# EAGLE design LilyPad_SimpleSnap_ProtoBoard (EAGLE 7.2.0)
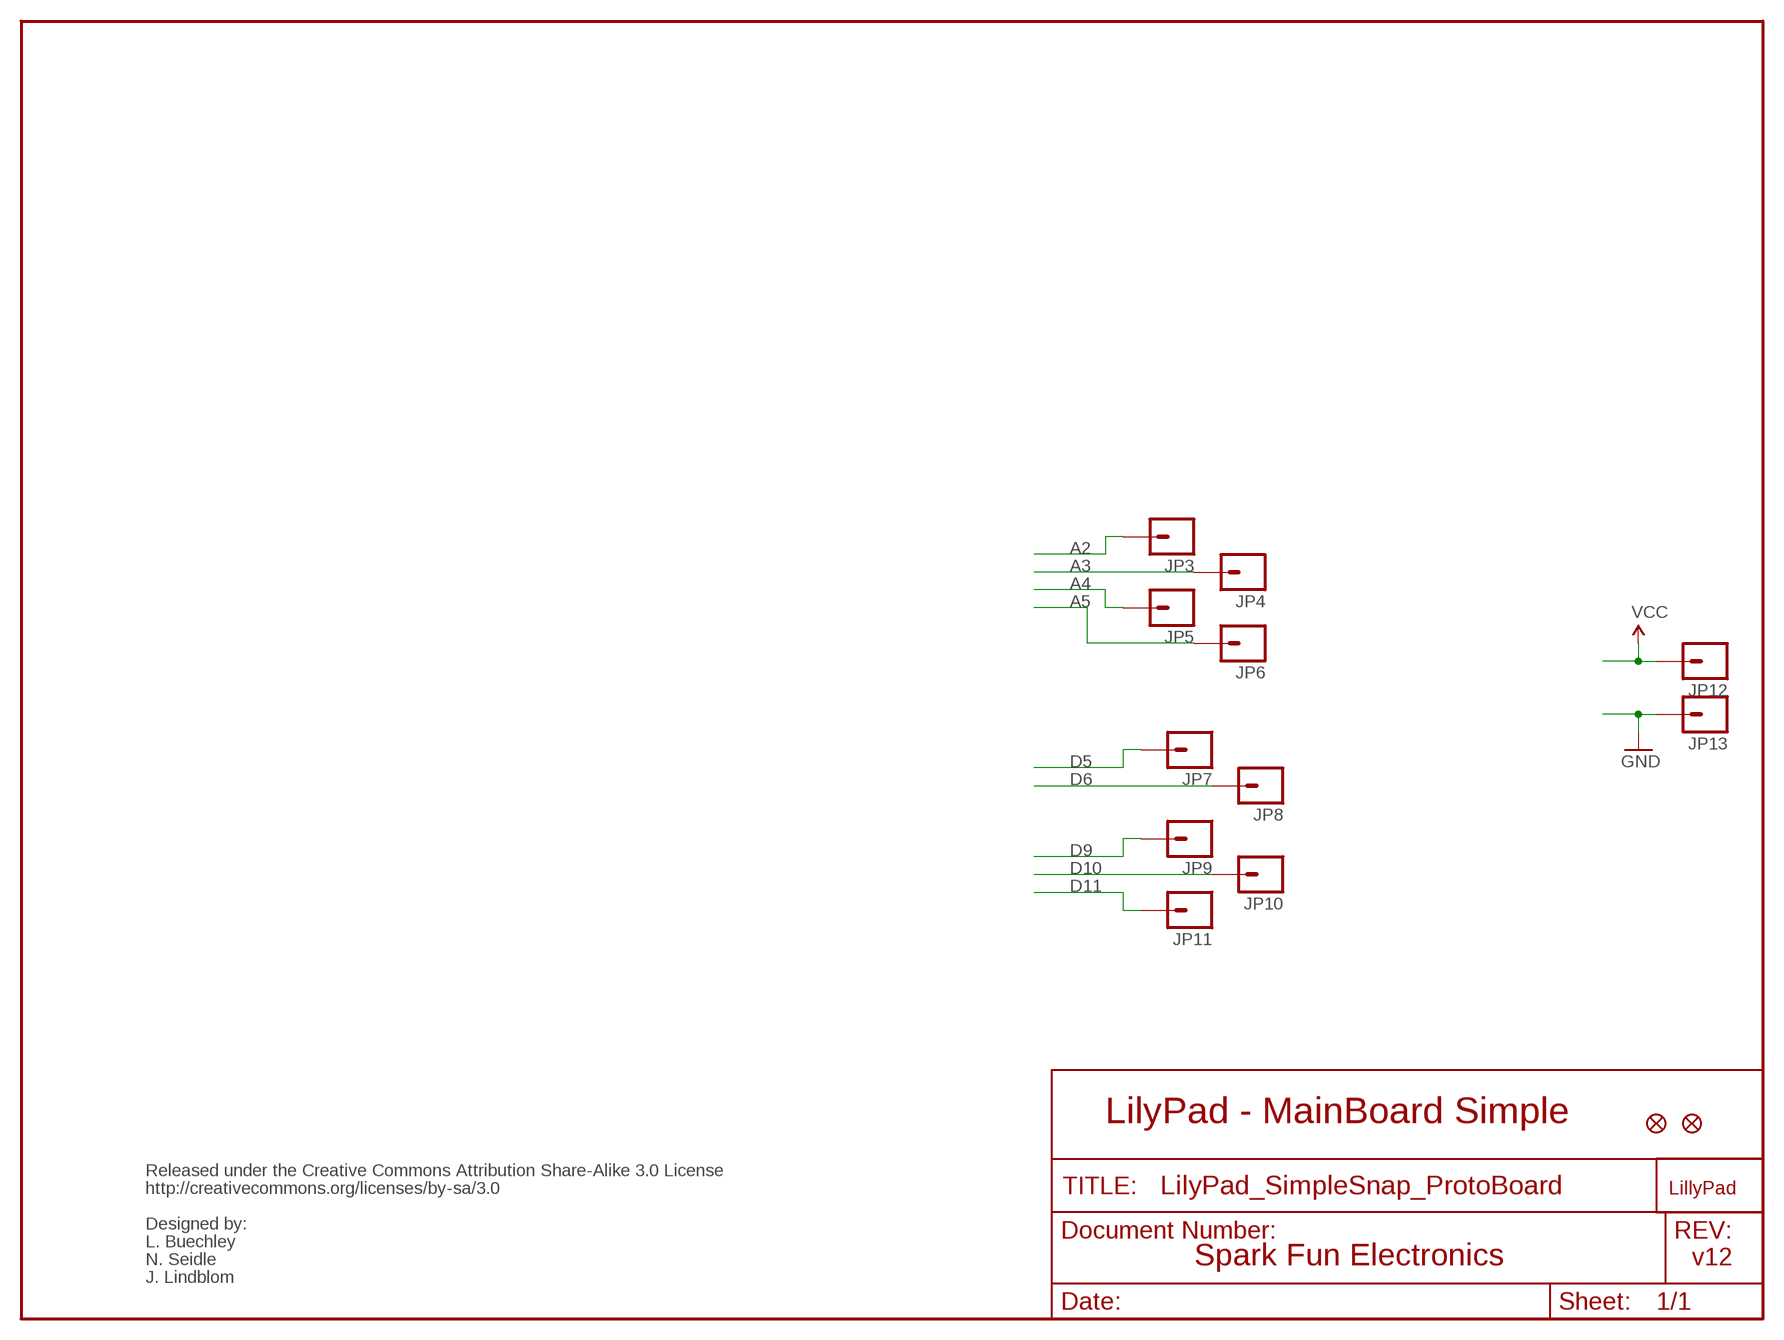
[diagram p0: schematic, sheet 1]

## Parts
JP1  FIDUCIALUFIDUCIAL  [MICRO-FIDUCIAL]
JP2  FIDUCIALUFIDUCIAL  [MICRO-FIDUCIAL]
JP3  M01SNAP-MALE_LARGE  [SNAP-MALE_LARGE]
JP4  M01SNAP-MALE_LARGE  [SNAP-MALE_LARGE]
JP5  M01SNAP-MALE_LARGE  [SNAP-MALE_LARGE]
JP6  M01SNAP-MALE_LARGE  [SNAP-MALE_LARGE]
JP7  M01SNAP-MALE_LARGE  [SNAP-MALE_LARGE]
JP8  M01SNAP-MALE_LARGE  [SNAP-MALE_LARGE]
JP9  M01SNAP-MALE_LARGE  [SNAP-MALE_LARGE]
JP10  M01SNAP-MALE_LARGE  [SNAP-MALE_LARGE]
JP11  M01SNAP-MALE_LARGE  [SNAP-MALE_LARGE]
JP12  M01SNAP-MALE_LARGE  [SNAP-MALE_LARGE]
JP13  M01SNAP-MALE_LARGE  [SNAP-MALE_LARGE]
U$1  LOGO-LPLP  [LOGO-LILYPAD]

## Nets
A2: JP3.2
A3: JP4.2
A4: JP5.2
A5: JP6.2
D5: JP7.2
D6: JP8.2
D9: JP9.2
D10: JP10.2
D11: JP11.2
GND [VCC]: JP13.2
VCC [VCC]: JP12.2

## Notes on the sheet
- LilyPad - MainBoard Simple
- Released under the Creative Commons Attribution Share-Alike 3.0 License
- http://creativecommons.org/licenses/by-sa/3.0
- Designed by:
- L. Buechley
- N. Seidle | Spark Fun Electronics | v12
- J. Lindblom

## Library data of the parts
JP1 JP2 = SparkFun:FIDUCIAL: Fiducial Alignment Points Various fiducial points for machine vision alignment.
JP3-JP13 = SparkFun:M01: Header 1 Standard 1-pin 0.1" header. Use with straight break away headers (SKU : PRT-00116), right angle break away headers (PRT-00553), swiss pins (PRT-00743), machine pins (PRT-00117), and female headers (PRT-00115).
U$1 = LilyPad-Wearables:LOGO-LP

## Net classes
0 Default: width 0.203 mm
1 VCC: width 0.254 mm

## Board
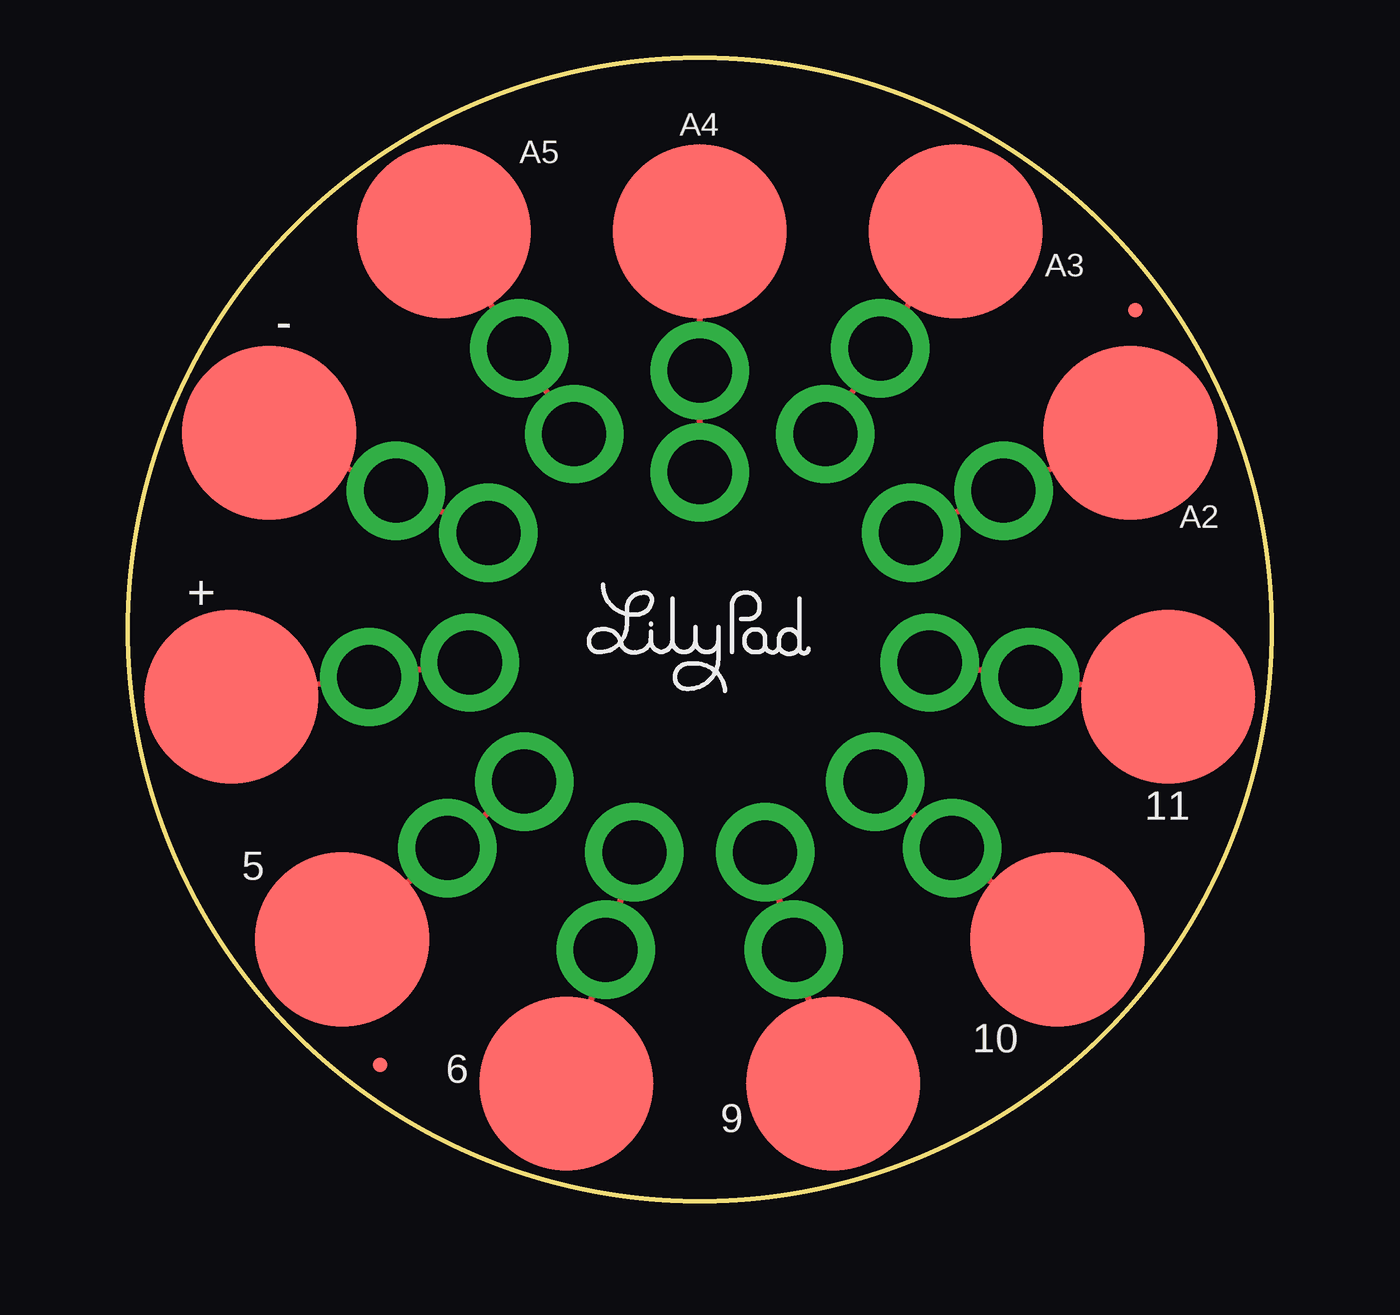
[diagram p1: board, top side]

Size 50 x 50 mm. Coordinates in mm from the lower left corner, seen from the top.
Outline: circle at 25,25 radius 25
Copper layers (1*16): Top 0.035mm / dielectric 1.5mm / Bottom 0.035mm
Design rules "default": minimum track width 8mil, minimum drill 20mil, track to track 8mil, track to pad 8mil, pad to pad 8mil, via to via 8mil, smd to smd 8mil, copper to edge 8mil, drill to drill 8mil, minimum pad ring 12mil, minimum via ring 10mil, stop-mask expansion 4mil, vias tented up to drill 20mil, thermal gap 10mil
bRestrict: area -3.2,-3.2 to 53.2,53.2; area 2.4,2.4 to 47.6,47.6; area 21,42.8 to 23.5,44; area 31.6,41.3 to 34.4,43; area 36.3,38.4 to 38.9,40.7; area 40,34.1 to 42,36.9; area 42.2,29.2 to 43.6,31.8; area 42.8,23.9 to 44,26.2; area 42.2,18.2 to 43.7,20.9; area 36.3,9.4 to 39,11.7; area 31.7,7 to 34.5,8.7; area 26.5,6 to 28.9,7.3; area 21.1,6 to 23.6,7.3; area 15.6,7 to 18.3,8.7; area 11,9.3 to 13.8,11.6; area 8,13.1 to 10.1,15.9; area 6.4,18.2 to 8,20.8; area 6,23.7 to 7.2,26.2; area 6.3,29.1 to 7.9,31.7; area 8,34 to 10.1,36.9; area 11,38.3 to 13.7,40.6; area 15.4,41.2 to 18.4,43; area 26.4,42.5 to 29.1,44; area 40,13 to 42,16.1; 22 lines

### Footprints (pad centres in the part's own frame; a part is rotated, then mirrored left to right if it is on the bottom)
MICRO-FIDUCIAL = smd 0.635 x 0.635: 1 0,0
SNAP-MALE_LARGE = smd 7.62 x 7.62: 2 0,0

### Placement (x,y rotation side)
JP1  11.03,5.95 0 top
JP2  44.05,38.97 0 top
JP3  43.83,33.6 0 top
JP4  36.19,42.41 0 top
JP5  25,42.41 0 top
JP6  13.81,42.41 0 top
JP7  9.36,11.44 0 top
JP8  19.17,5.14 0 top
JP9  30.83,5.14 0 top
JP10  40.64,11.44 0 top
JP11  45.49,22.05 0 top
JP12  4.51,22.05 0 top
JP13  6.17,33.6 0 top
U$1  25,24.97 0 top

### Tracks (layer width: path | path; a pad name or v marks a point on that pad's centre or on a via)
A2  (via drill 2.8 pad 4.3)
  Top 0.254: v34.24,29.22 v38.28,31.07 JP3.2
A3  (via drill 2.8 pad 4.3)
  Top 0.254: v30.49,33.55 v32.9,37.29 JP4.2
A4  (via drill 2.8 pad 4.3)
  Top 0.254: v25,31.87 v25,36.32 JP5.2
A5  (via drill 2.8 pad 4.3)
  Top 0.254: v19.51,33.55 v17.1,37.29 JP6.2
D5  (via drill 2.8 pad 4.3)
  Top 0.254: v17.32,18.35 v13.96,15.44 JP7.2
D6  (via drill 2.8 pad 4.3)
  Top 0.254: v22.14,15.25 v20.88,10.99 JP8.2
D9  (via drill 2.8 pad 4.3)
  Top 0.254: v27.86,15.25 v29.12,10.99 JP9.2
D10  (via drill 2.8 pad 4.3)
  Top 0.254: v32.68,18.35 v36.04,15.44 JP10.2
D11  (via drill 2.8 pad 4.3)
  Top 0.254: v35.06,23.55 v39.46,22.92 JP11.2
GND  (via drill 2.8 pad 4.3)
  Top 0.254: v15.76,29.22 v11.71,31.07 JP13.2
VCC  (via drill 2.8 pad 4.3)
  Top 0.254: v14.94,23.55 v10.54,22.92 JP12.2

### Text on the board
tPlace: A4 | A5 | A3 | - | A2 | + | 11 | 5 | 10 | 6 | 9